# EasyEDA Pro project F40_USB_HUB_2026-08-06.epro

# Schematic Schematic1
Board Name: Board1; Create Date: 2026-07-31; Page Name: P1; Project Name: Simone USB_HUB; Schematic Name: Schematic1; Update Date: 2026-07-31; Company: EasyEDA.com; Page Size: A4; Version: V1.0
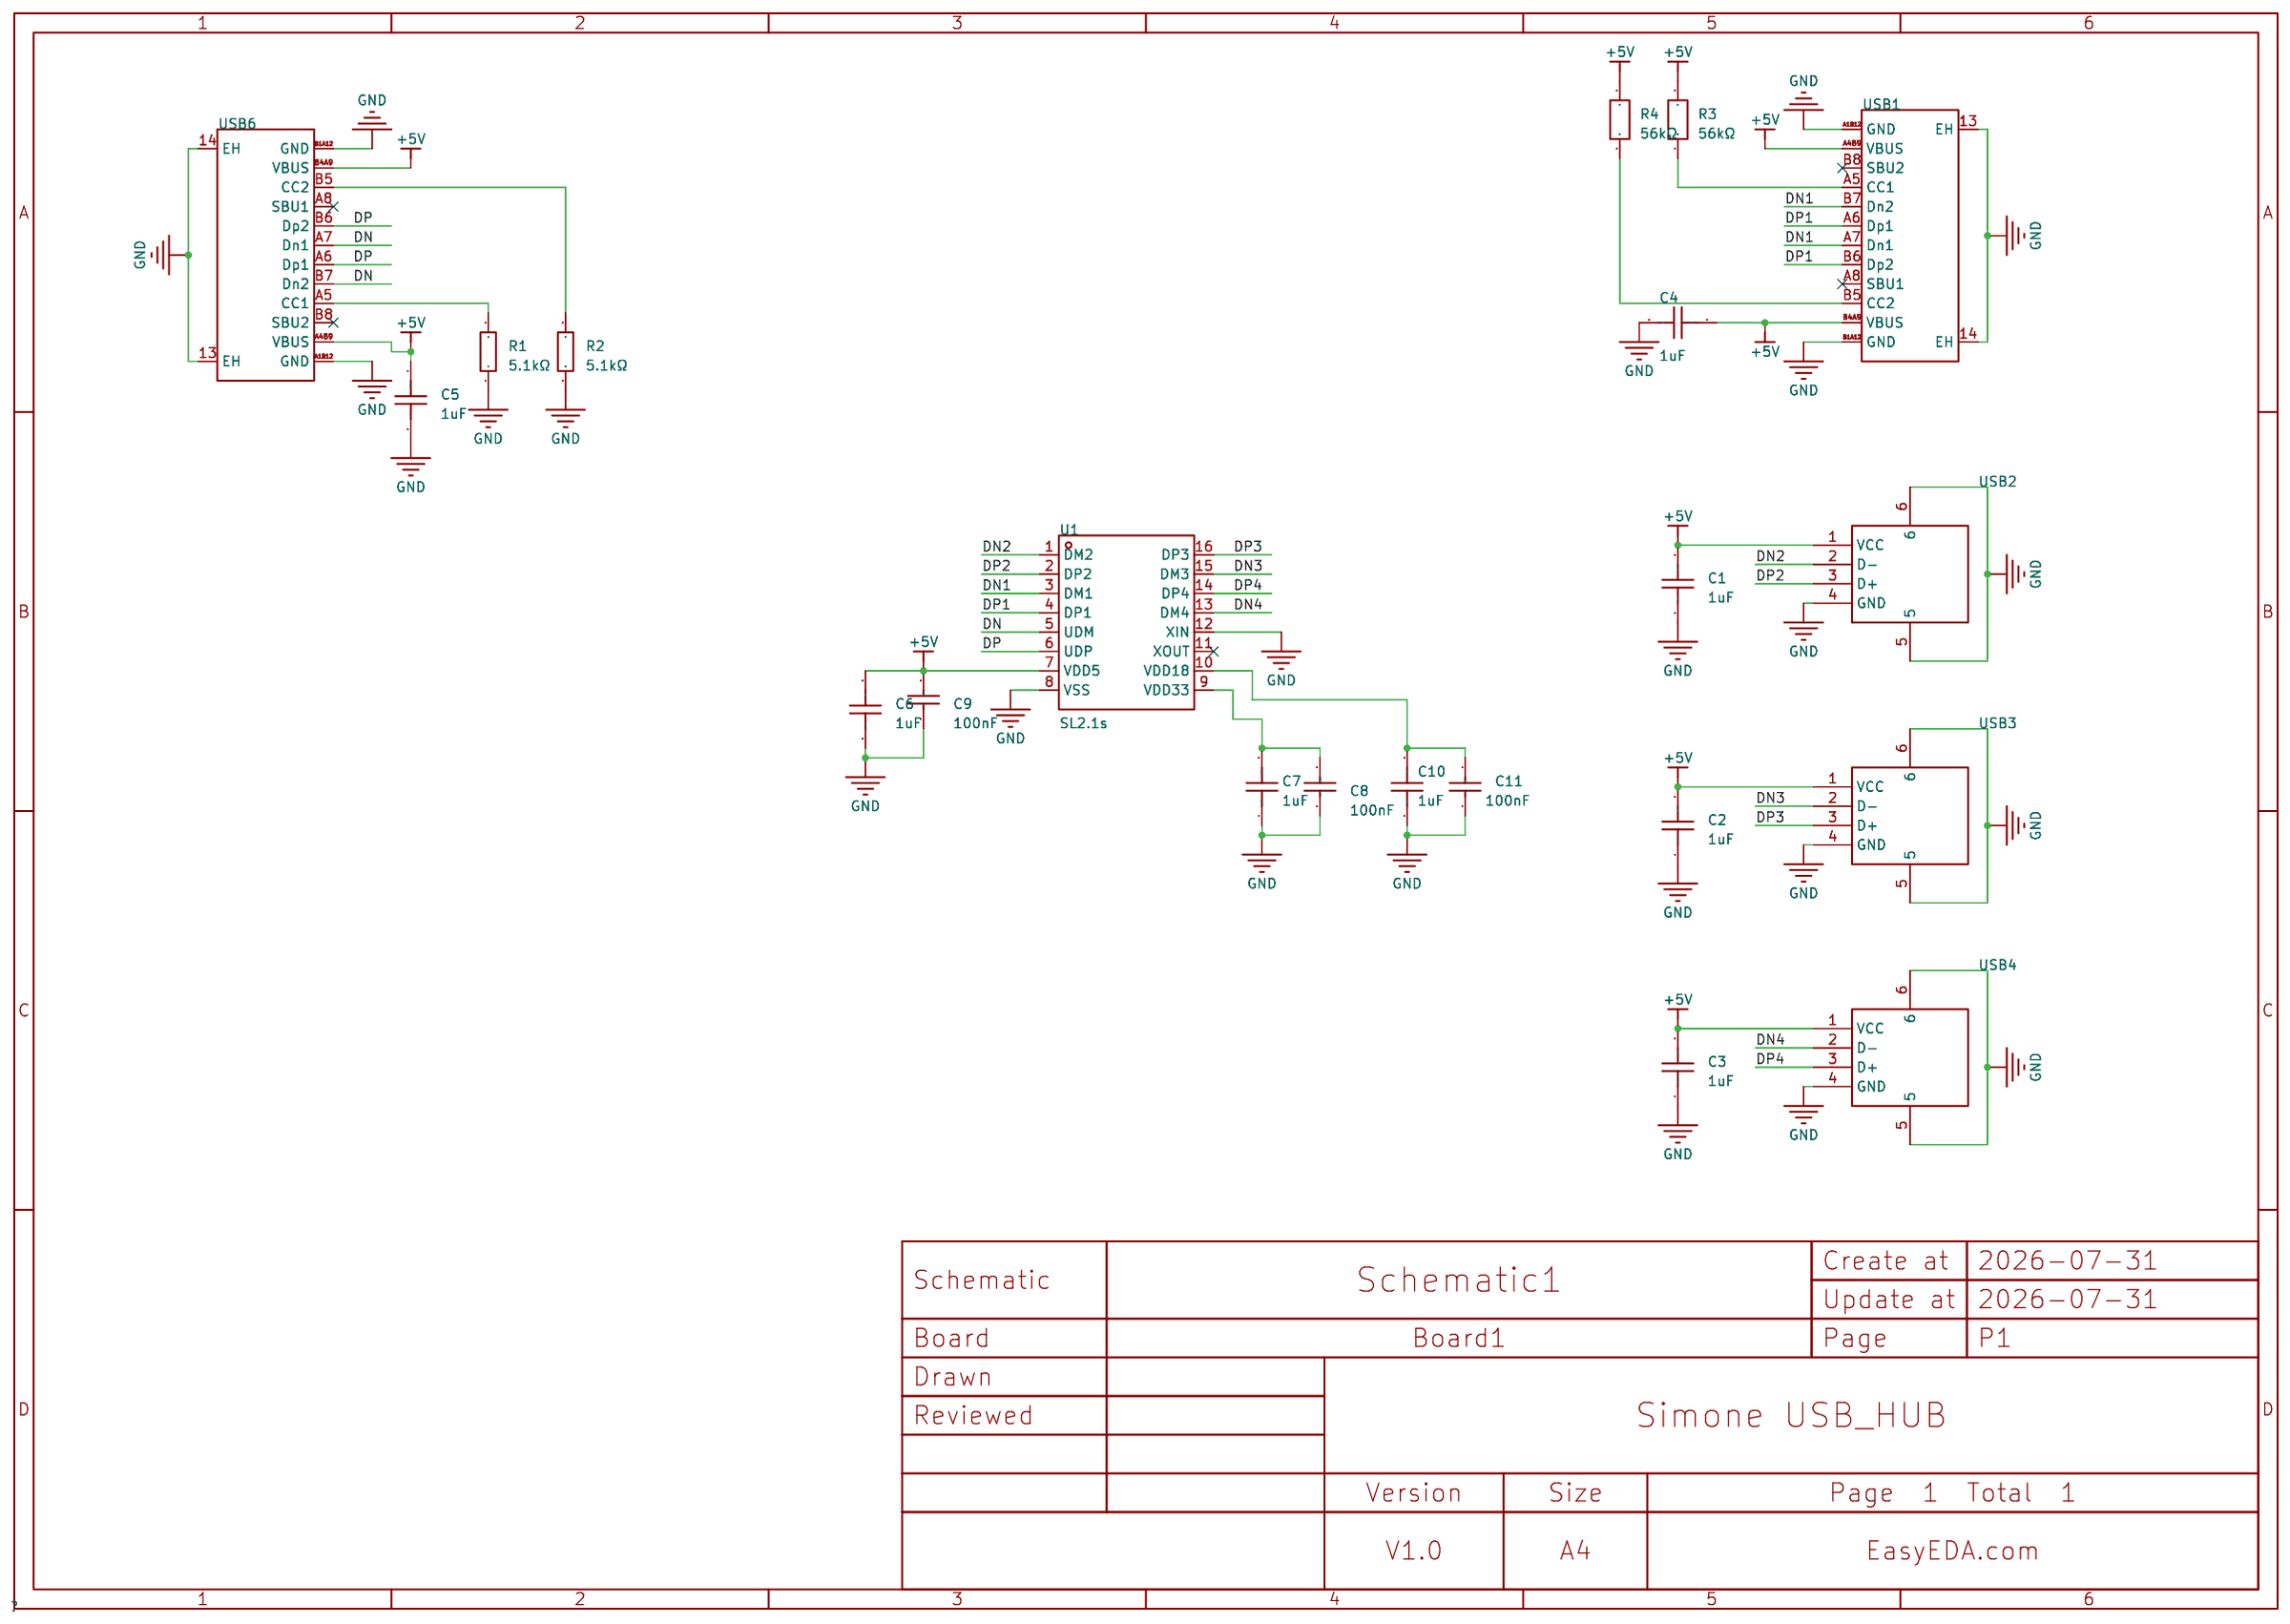
[diagram p0: schematic sheet]

## Parts
C1  1uF  [C0603]
C2  1uF  [C0603]
C3  1uF  [C0603]
C4  1uF  [C0603]
C5  1uF  [C0603]
C6  1uF  [C0603]
C7  1uF  [C0603]
C8  100nF  [C0603]
C9  100nF  [C0603]
C10  1uF  [C0603]
C11  100nF  [C0603]
R1  5.1kΩ  [R0603]
R2  5.1kΩ  [R0603]
R3  56kΩ  [R0603]
R4  56kΩ  [R0603]
U1  SL2.1s  [SSOP-16_L4.6-W2.6-P0.53-LS4.0-BL]
USB1  TYPE-C 16PIN 2MD(073)  [USB-C-SMD_TYPE-C-16PIN-2MD-073]
USB2  10.0 QHHTZB6.3  [USB-A-TH_10.0QHHTZB6.3]
USB3  10.0 QHHTZB6.3  [USB-A-TH_10.0QHHTZB6.3]
USB4  10.0 QHHTZB6.3  [USB-A-TH_10.0QHHTZB6.3]
USB6  TYPE-C 16PIN 2MD(073)  [USB-C-SMD_TYPE-C-16PIN-2MD-073]

## Library data of the parts
C1-C7 C10 = CL10A105KB8NNNC: Capacitance:1uF Tolerance:±10% Tolerance:±10% Voltage Rating:50V Temperature Coefficient:X5R; LCSC Part Name: 1uF ±10% 50V; Supplier Part: C15849; Manufacturer: SAMSUNG(三星); Supplier Footprint: 0603; JLCPCB Part Class: Basic Part; Datasheet: https://item.szlcsc.com/datasheet/CL10A105KB8NNNC/16531.html; Supplier: LCSC; Tolerance: ±10%; Voltage Rating: 50V; Temperature Coefficient: X5R
C8 C9 C11 = CC0603JRX7R9BB104: Capacitance: Tolerance:±5% Tolerance:±5% Voltage Rated: Temperature Coefficient:; LCSC Part Name: 100nF ±5% 50V; Supplier Part: C91183; Manufacturer: YAGEO(国巨); Supplier Footprint: 0603; JLCPCB Part Class: Extended Part; Datasheet: https://atta.szlcsc.com/upload/public/pdf/source/20170919/C131031_1505787245477976978.pdf; Supplier: LCSC; Tolerance: ±5%
R1 R2 = 0603WAF5101T5E: Type:Thick Film Resistor Resistance:5.1kΩ Tolerance:±1% Tolerance:±1% Power(Watts):100mW Voltage-Supply(Max):75V Temperature Coefficient:±100ppm/℃ Temperature Coefficient:±100ppm/℃ Operating Temperature:-55℃~+155℃ Operating Temperature:-55℃~+155℃; LCSC Part Name: 5.1kΩ ±1% 100mW 厚膜电阻; Supplier Part: C23186; Manufacturer: UNI-ROYAL(厚声); Supplier Footprint: 0603; JLCPCB Part Class: Basic Part; Datasheet: https://item.szlcsc.com/datasheet/0603WAF5101T5E/23913.html; Supplier: LCSC; Type: Thick Film Resistor; Tolerance: ±1%; Power(Watts): 100mW; Voltage-Supply(Max): 75V; Temperature Coefficient: ±100ppm/℃; Operating Temperature: -55℃~+155℃
R3 R4 = SCR0603J56K: Type:Thick Film Resistor Resistance:56kΩ Tolerance:±5% Tolerance:±5% Power(Watts):100mW Voltage-Supply(Max):75V Operating Temperature:-55℃~+155℃ Operating Temperature:-55℃~+155℃; LCSC Part Name: 厚膜电阻 56kΩ ±5% 100mW; Supplier Part: C3017697; Manufacturer: VO(翔胜); Supplier Footprint: 0603; JLCPCB Part Class: Extended Part; Datasheet: https://item.szlcsc.com/datasheet/SCR0603J56K/3530221.html; Supplier: LCSC; Type: Thick Film Resistor; Tolerance: ±5%; Power(Watts): 100mW; Voltage-Supply(Max): 75V; Operating Temperature: -55℃~+155℃
U1 = SL2.1s: type:Hub USB Protocol:USB 2.0 Data Rate:- Voltage - Supply:4V~5.25V Voltage - Supply:4V~5.25V Operating Temperature:0℃~+70℃ Operating Temperature:0℃~+70℃ Memory Interface:- Current - Supply:120mA Quiescent Supply Current:2.5mA Number of Channels:4; LCSC Part Name: USB2.0 HUB控制器集成电路; Supplier Part: C2684433; Manufacturer: CoreChips(和芯润德); Supplier Footprint: SSOP-16; JLCPCB Part Class: Extended Part; Datasheet: https://item.szlcsc.com/datasheet/SL2.1s/2782346.html; Supplier: LCSC; type: Hub; USB Protocol: USB 2.0; Voltage - Supply: 4V~5.25V; Operating Temperature: 0℃~+70℃; Current - Supply: 120mA; Quiescent Supply Current: 2.5mA; Number of Channels: 4
USB1 USB6 = TYPE-C 16PIN 2MD(073): Connector Type:Type-C Protocol Standard:- Gender:Female Mounting Type:Surface Mount, Right Angle Number of Contacts:16P Number of Ports:1 Current Rating-Power:3A Voltage Rating:5V Connect-Disconnect Life:10,000 cycles Supplementary Features:- Center Heigh; LCSC Part Name: Type-C 母 卧贴; Supplier Part: C2765186; Manufacturer: SHOU HAN(首韩); Supplier Footprint: SMD; JLCPCB Part Class: Extended Part; Datasheet: https://item.szlcsc.com/datasheet/TYPE-C%252016PIN%25202MD(073)/2901843.html; Supplier: LCSC; Connector Type: Type-C; Gender: Female; Mounting Type: Surface Mount, Right Angle; Number of Contacts: 16P; Number of Ports: 1; Current Rating-Power: 3A; Voltage Rating: 5V; Connect-Disconnect Life: 10,000 cycles; Detection color: Black; Operating Temperature: -25℃~+85℃
USB2-USB4 = 10.0 QHHTZB6.3: Connector Type:Type-A Protocol Standard:USB 2.0 Gender:Female Mounting Type:Surface Mount, Right Angle Number of Contacts:4P Number of Ports:1 Current Rating-Power:1.5A Voltage Rating:30V Connect-Disconnect Life:5,000 times Supplementary Features:- Center; LCSC Part Name: 壳长10.0mm; Supplier Part: C668591; Manufacturer: SHOU HAN(首韩); Supplier Footprint: SMD; JLCPCB Part Class: Extended Part; Datasheet: https://item.szlcsc.com/datasheet/10.0%2520QHHTZB6.3/698534.html; Supplier: LCSC; Connector Type: Type-A; Protocol Standard: USB 2.0; Gender: Female; Mounting Type: Surface Mount, Right Angle; Number of Contacts: 4P; Number of Ports: 1; Current Rating-Power: 1.5A; Voltage Rating: 30V; Connect-Disconnect Life: 5,000 times; Length: 10mm; Detection color: Black; Operating Temperature: -25℃~+85℃

## Nets
+5V: C1.2 C2.2 C3.2 C4.1 C5.1 C6.2 C9.2 R3.2 R4.2 U1.7(VDD5) USB1.A4B9(VBUS) USB1.B4A9(VBUS) USB2.1(VCC) USB3.1(VCC) USB4.1(VCC) USB6.A4B9(VBUS) USB6.B4A9(VBUS)
GND: C1.1 C2.1 C3.1 C4.2 C5.2 C6.1 C7.1 C8.1 C9.1 C10.1 C11.1 R1.1 R2.2 U1.8(VSS) U1.12(XIN) USB1.13(EH) USB1.14(EH) USB1.A1B12(GND) USB1.B1A12(GND) USB2.4(GND) USB2.5 USB2.6 USB3.4(GND) USB3.5 USB3.6 USB4.4(GND) USB4.5 USB4.6 USB6.13(EH) USB6.14(EH) USB6.A1B12(GND) USB6.B1A12(GND)
DN: U1.5(UDM) USB6.A7(Dn1) USB6.B7(Dn2)
DN1: U1.3(DM1) USB1.A7(Dn1) USB1.B7(Dn2)
DN2: U1.1(DM2) USB2.2(D-)
DN3: U1.15(DM3) USB3.2(D-)
DN4: U1.13(DM4) USB4.2(D-)
DP: U1.6(UDP) USB6.A6(Dp1) USB6.B6(Dp2)
DP1: U1.4(DP1) USB1.A6(Dp1) USB1.B6(Dp2)
DP2: U1.2(DP2) USB2.3(D+)
DP3: U1.16(DP3) USB3.3(D+)
DP4: U1.14(DP4) USB4.3(D+)
$1N13: R2.1 USB6.B5(CC2)
$1N14: R1.2 USB6.A5(CC1)
$1N55: R4.1 USB1.B5(CC2)
$1N56: R3.1 USB1.A5(CC1)
$1N68: C10.2 C11.2 U1.10(VDD18)
$1N69: C7.2 C8.2 U1.9(VDD33)

Not connected (* = marked no-connect by the designer): U1 11(XOUT)*; USB1 A8(SBU1)* B8(SBU2)*; USB6 A8(SBU1)* B8(SBU2)*

# Board PCB1
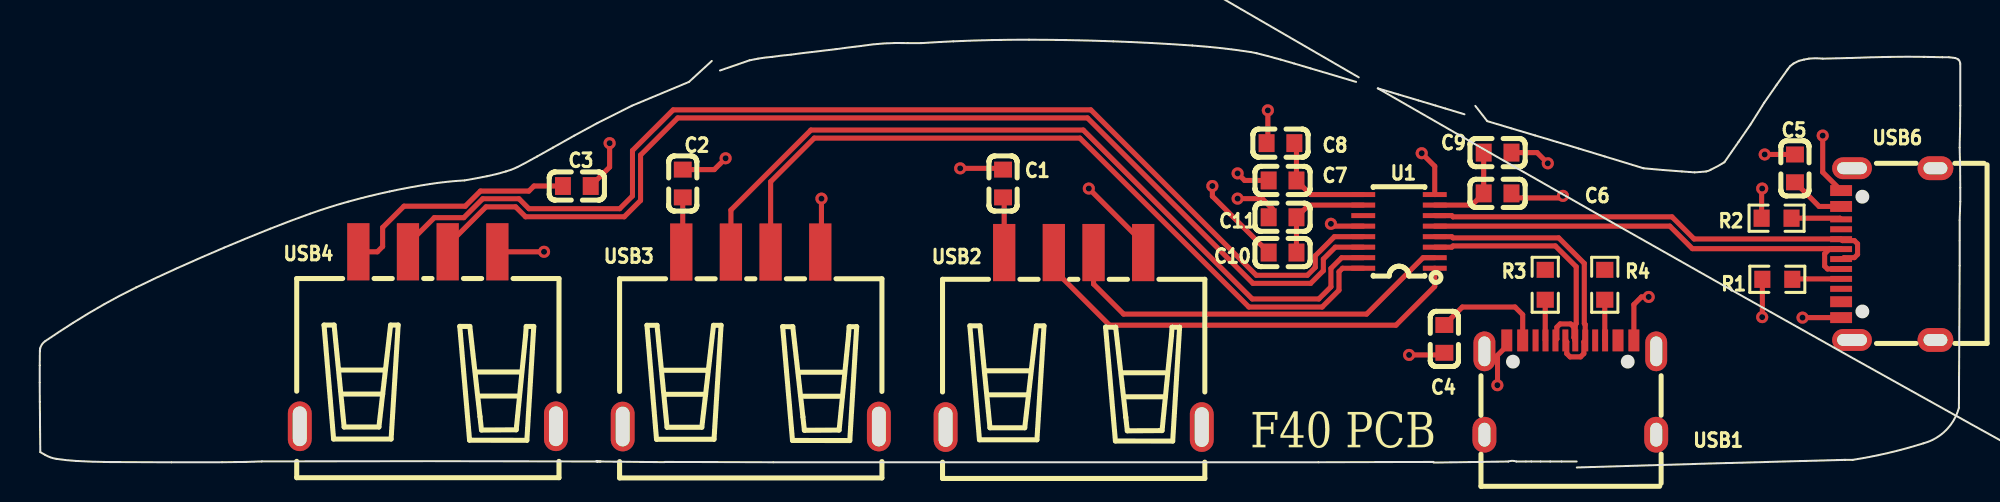
[diagram p1: board, top side]
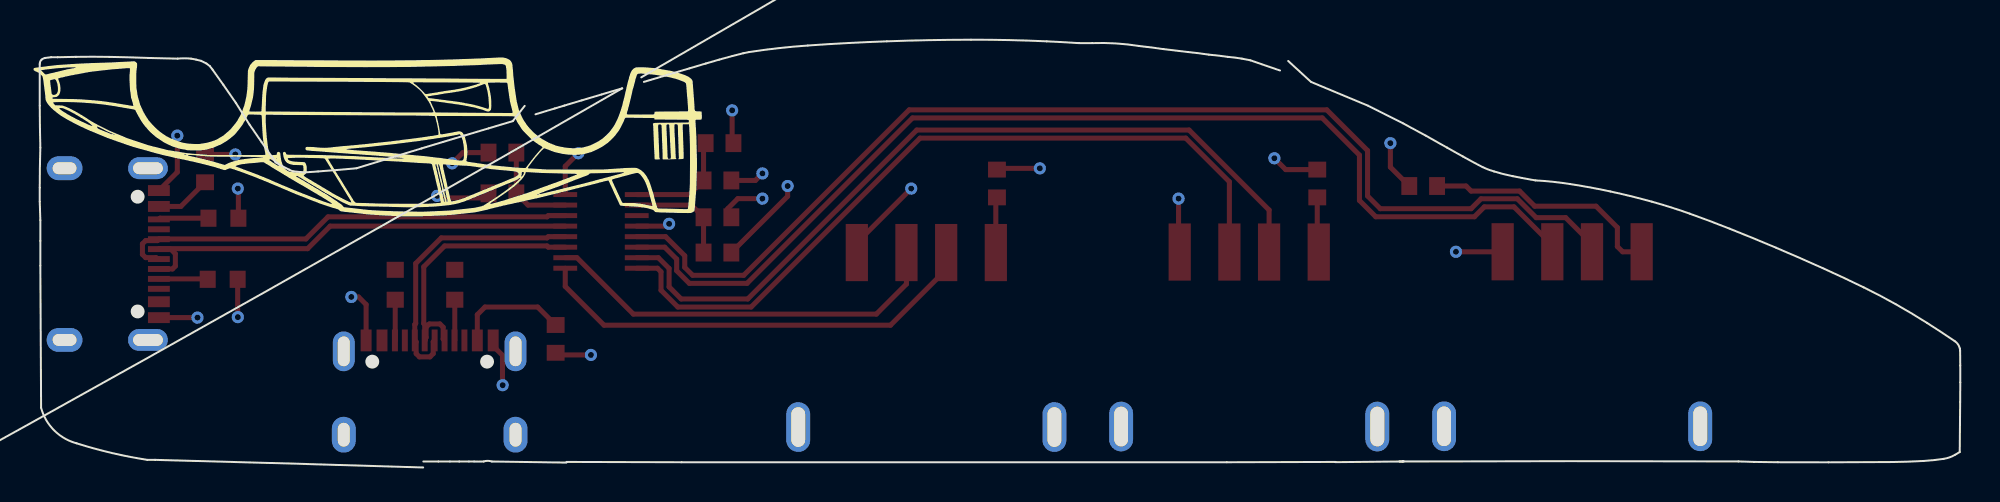
[diagram p2: board, bottom side, seen from below]

Outline 96.71 x 21.29 mm; copper layers: Top Layer, Bottom Layer. Coordinates in mm from the lower left corner of the outline.
Outline path: 28.08,0.05 arc(19.63,0.06) 11.18,0.05 arc(10.79,0.04) 10.41,0.03 arc(9.8,0.01) 9.19,0.01 arc(7.92,0.01) 6.64,0.01 arc(5.06,0.01) 3.48,0.02 arc(2.66,0.04) 1.84,0.07 arc(1.34,0.12) 0.84,0.18 arc(0.55,0.25) 0.27,0.38 0.03,0.52 0.01,3.05 arc(0,3.54) 0,4.03 arc(0,4.46) 0,4.89 arc(0.01,5.25) 0.01,5.62 arc(0.01,5.68) 0.03,5.74 arc(0.12,5.95) 0.28,6.11 arc(0.97,6.57) 1.67,7.03 arc(2.46,7.51) 3.26,7.98 arc(4.06,8.41) 4.87,8.82 arc(5.9,9.31) 6.94,9.79 arc(8.11,10.31) 9.29,10.82 arc(10.45,11.3) 11.61,11.77 arc(12.62,12.16) 13.63,12.53 arc(14.58,12.85) 15.54,13.14 arc(16.58,13.41) 17.62,13.65 arc(18.64,13.85) 19.65,14.02 arc(20.53,14.14) 21.4,14.21 arc(21.97,14.31) 22.53,14.42 arc(23.01,14.52) 23.48,14.66 arc(23.77,14.75) 24.05,14.87 arc(24.56,15.14) 25.06,15.41 arc(25.45,15.64) 25.85,15.86 arc(26.38,16.16) 26.92,16.46 arc(27.5,16.78) 28.08,17.09 arc(28.95,17.53) 29.83,17.97 32.7,19.17 arc(33.17,20.21) 34.24,19.79 arc(35.4,19.75) 35.75,20.26 arc(35.96,20.3) 36.17,20.34 arc(36.53,20.39) 36.89,20.43 arc(37.36,20.49) 37.84,20.54 arc(38.36,20.61) 38.88,20.67 40.11,20.82 arc(40.74,20.9) 41.37,20.98 arc(42.54,21.11) 43.71,21.12 arc(44.05,21.12) 44.38,21.12 arc(45.2,21.17) 46.01,21.21 arc(47.91,21.27) 49.82,21.29 arc(51.94,21.27) 54.06,21.21 arc(56.05,21.12) 58.05,21 arc(59.52,20.87) 60.99,20.67 arc(61.13,20.65) 61.28,20.61 arc(61.56,20.54) 61.84,20.47 arc(62.17,20.38) 62.49,20.29 arc(62.83,20.19) 63.17,20.09 arc(1419.49,284.62) 63.99,19.85 66.29,19.17 arc(66.92,19.27) 67.38,18.84 arc(67.9,18.69) 68.42,18.54 arc(68.92,18.39) 69.43,18.24 arc(69.86,18.11) 70.29,17.98 arc(70.53,17.9) 70.78,17.83 arc(71.26,17.68) 71.75,17.54 arc(72.32,17.36) 72.89,17.19 arc(73.5,17.01) 74.11,16.83 arc(74.7,16.65) 75.3,16.47 arc(75.86,16.31) 76.42,16.14 arc(76.96,15.98) 77.49,15.81 arc(78.15,15.62) 78.81,15.41 arc(817.54,-1867.16) 80.76,14.82 arc(81.73,14.73) 82.69,14.66 arc(82.89,14.64) 83.09,14.63 arc(83.21,14.62) 83.33,14.61 arc(83.47,14.62) 83.6,14.63 arc(83.76,14.64) 83.92,14.66 arc(84.04,14.69) 84.15,14.74 arc(84.5,14.92) 84.84,15.12 arc(85.19,15.63) 85.54,16.14 arc(85.85,16.58) 86.15,17.02 arc(86.5,17.57) 86.84,18.12 arc(87.16,18.57) 87.47,19.03 arc(87.75,19.41) 88.02,19.79 arc(88.08,19.88) 88.15,19.96 arc(88.23,20.03) 88.32,20.1 arc(88.45,20.16) 88.59,20.23 arc(88.71,20.26) 88.84,20.29 arc(88.97,20.32) 89.09,20.34 arc(89.44,20.36) 89.78,20.34 arc(90.52,20.36) 91.26,20.37 arc(92.23,20.41) 93.2,20.43 arc(94.05,20.44) 94.89,20.43 arc(95.35,20.42) 95.81,20.41 arc(95.98,20.41) 96.14,20.41 arc(96.29,20.4) 96.44,20.37 arc(96.54,20.34) 96.62,20.29 arc(96.69,20.19) 96.71,20.07 arc(96.72,19.02) 96.71,17.97 arc(96.71,16.91) 96.68,15.86 arc(96.71,14.85) 96.71,13.84 arc(96.72,13.49) 96.71,13.14 arc(96.7,12.67) 96.68,12.2 arc(96.69,11.68) 96.68,11.16 arc(96.69,10.54) 96.68,9.91 96.65,2.75 arc(95.99,1.62) 94.86,0.96 arc(93.1,0.48) 91.3,0.13 arc(91.1,0.13) 90.9,0.13 arc(91.49,-1202.3) 77.4,0.05 arc(77.02,0.05) 76.64,0.05 arc(76.35,0.05) 76.07,0.05 arc(75.83,0.05) 75.59,0.05 arc(75.35,0.05) 75.11,0.05 arc(74.98,0.05) 74.84,0.05 arc(74.6,0.04) 74.36,0.05 arc(74.16,0.08) 73.95,0.05 arc(25.06,-158.66) 70.19,0.02 arc(67.29,0.01) 64.39,0.01 36.94,0.01 arc(34.21,0.01) 31.47,0.02 arc(30.69,141.17) 28.08,0.05 ; 28.08,0.05 arc(28.05,0.05) 28.03,0.05 arc(67.46,1199.52) 28.24,0.05 arc(28.16,0.05) 28.08,0.05
Stack: Top Layer 0.035mm / Dielectric1 1.51mm FR4 er 4.5 / Bottom Layer 0.035mm

## Design rules (mm)
net DN2: DP3
net DP2: DP3
net DN1: DP2
net DP1: DP2
net DN: DP1
net DP: DP1
net DN4: DP4
net DP4: DP4
net DN3: DP5
net DP3: DP5
spacing copperThickness1oz (default): track to track 0.102, other pairs 0.152 to 0.3
spacing copperThickness2oz: track to track 0.203, other pairs 0.152 to 0.3
track width copperThickness1oz (default): min 0.127, default 0.254, max 2.54
track width copperThickness2oz: min 0.203, default 0.254, max 2.54
differential pair differentialPair (default): width min 0.127, default 0.254, max 2.54; gap min 0.152, default 0.152
net +5V uses copperRegion
net GND uses copperRegion

## Placement (name value [footprint] x y rotation side)
C1  1uF  [C0603]  48.51 14.04 270 top
C2  1uF  [C0603]  32.38 14.04 270 top
C3  1uF  [C0603]  27.05 13.92 180 top
C4  1uF  [C0603]  70.73 6.22 270 top
C5  1uF  [C0603]  88.39 14.81 90 top
C6  1uF  [C0603]  73.41 13.55 180 top
C7  1uF  [C0603]  62.58 14.2 0 top
C8  100nF  [C0603]  62.48 16.08 0 top
C9  100nF  [C0603]  73.41 15.6 180 top
C10  1uF  [C0603]  62.58 10.57 0 top
C11  100nF  [C0603]  62.58 12.34 0 top
R1  5.1kΩ  [R0603]  87.5 9.22 0 top
R2  5.1kΩ  [R0603]  87.46 12.3 180 top
R3  56kΩ  [R0603]  75.81 8.94 90 top
R4  56kΩ  [R0603]  78.81 8.94 90 top
U1  SL2.1s  [SSOP-16_L4.6-W2.6-P0.53-LS4.0-BL]  68.45 11.63 90 top
USB1  TYPE-C 16PIN 2MD(073)  [USB-C-SMD_TYPE-C-16PIN-2MD-073]  77.08 3.77 0 top
USB2  10.0 QHHTZB6.3  [USB-A-TH_10.0QHHTZB6.3]  52.07 6.17 0 top
USB3  10.0 QHHTZB6.3  [USB-A-TH_10.0QHHTZB6.3]  35.81 6.2 0 top
USB4  10.0 QHHTZB6.3  [USB-A-TH_10.0QHHTZB6.3]  19.54 6.21 0 top
USB6  TYPE-C 16PIN 2MD(073)  [USB-C-SMD_TYPE-C-16PIN-2MD-073]  93.09 10.49 90 top

## Footprints (pads in the part's own frame, mm; a bottom-side part is the same pattern mirrored in y, then rotated)
C0603
  rect 0.8x0.9 smd: 1(-0.7,0) 2(0.7,0)
R0603
  rect 0.806x0.864 smd: 1(-0.753,0) 2(0.753,0)
SSOP-16_L4.6-W2.6-P0.53-LS4.0-BL
  rect 0.25x1.2 smd: 1(-1.855,-1.8) 2(-1.325,-1.8) 3(-0.795,-1.8) 4(-0.265,-1.8) 5(0.265,-1.8) 6(0.795,-1.8) 7(1.325,-1.8) 8(1.855,-1.8) 9(1.855,1.8) 10(1.325,1.8) 11(0.795,1.8) 12(0.265,1.8) 13(-0.265,1.8) 14(-0.795,1.8) 15(-1.325,1.8) 16(-1.855,1.8)
USB-A-TH_10.0QHHTZB6.3
  rect 1.12x2.88 smd: 1(-3.5,4.395) 2(-1,4.395) 3(1,4.395) 4(3.5,4.395)
  oval 1.2x2.5 hole 0.7x2: 5(-6.45,-4.395) 6(6.45,-4.395)
USB-C-SMD_TYPE-C-16PIN-2MD-073
  oval 1.1x2 hole 0.6x1.5: 13(-4.325,1.825) 14(4.325,1.825)
  oval 1.2x1.8 hole 0.6x1.2: 13(-4.325,-2.375) 14(4.325,-2.375)
  rect 0.55x1.1 smd: A1B12(-3.2,2.375) A4B9(-2.4,2.375) B1A12(3.2,2.375) B4A9(2.4,2.375)
  rect 0.3x1.1 smd: A5(-1.25,2.375) A6(-0.25,2.375) A7(0.25,2.375) A8(1.25,2.375) B5(1.75,2.375) B6(0.75,2.375) B7(-0.75,2.375) B8(-1.75,2.375)

## Nets
As in the schematic.

Pads without a net: U1 11; USB1 A8 B8; USB6 A8 B8

## Via types
v1: diameter 0.61, hole 0.305, Top Layer to Bottom Layer, 22 vias

## Routing (per net, layer and track width the routed paths; a pad name or vN(x,y) marks a point on that pad's centre or on a via; arc(x,y) is an arc through that point)
+5V: length 31.2
  Top Layer w0.254: USB4.1 17,10.6 17.27,10.87 17.27,11.83 18.34,12.9 21.43,12.9 22.19,13.66 24.63,13.66 24.89,13.92 C3.2 ; 48.51,13.34 48.57,13.29 USB2.1 ; C5.1 89.61,12.89 USB6.B4A9 ; USB1.A4B9 74.68,7.43 74.29,7.82 71.64,7.82 C4.1 ; 32.38,13.34 32.38,10.67 USB3.1 ; 70.25,12.96 72.12,12.96 C6.2 C9.2
GND: length 52.7
  Top Layer w0.254: 61.88,12.34 62.06,12.52 62.06,12.78 61.56,13.28 v1(60.32,13.28) ; C1.1 48.45,14.81 v1(46.35,14.81) ; v1(86.74,13.79) 86.71,13.76 R2.2 ; USB1.A1B12 73.88,5.86 73.41,5.39 73.41,3.89 v1(73.4,3.88) ; v1(89.78,16.46) 89.78,14.61 USB6.B1A12 ; 61.88,10.56 59.05,13.4 v1(59.05,13.92) ; v1(86.74,7.31) 86.75,7.32 R1.1 ; v1(28.7,16.08) 28.7,14.87 C3.1 ; v1(52.83,13.79) 55.57,11.05 USB2.4 ; v1(39.37,13.28) 39.37,10.65 USB3.4 ; v1(75.94,15.06) 75.4,15.6 C9.1 ; 61.88,16.1 61.84,16.14 v1(61.84,17.73) ; USB4.4 v1(25.4,10.6) ; C5.2 v1(86.86,15.51) ; v1(69.59,15.57) 70.25,14.91 70.25,13.49 ; 61.88,14.2 60.68,14.2 v1(60.32,14.55) ; C2.1 33.97,14.74 v1(34.54,15.31) ; v1(68.96,5.41) 70.62,5.41 C4.2 ; USB1.B1A12 80.28,7.95 80.66,8.33 v1(81.02,8.33) ; v1(76.7,13.42) 76.6,13.32 74.34,13.32 C6.1 ; USB6.A1B12 v1(88.77,7.29) ; v1(65.02,12.01) 65.14,11.9 U1.12
DN: length 23.4
  Top Layer w0.254: 90.71,10.74 USB6.A7 ; 90.71,10.74 90.12,10.74 89.88,10.5 89.88,9.88 90.03,9.74 USB6.B7 ; 90.71,10.74 90.69,10.76 83.22,10.76 82.09,11.9 70.25,11.9
DN1: length 13.7
  Top Layer w0.254: 76.33,6.14 76.4,6.21 76.4,6.8 76.56,6.97 77.09,6.97 77.26,6.8 77.26,6.28 77.3,6.24 77.3,6.16 77.33,6.14 77.33,6.94 77.37,6.99 77.37,9.85 76.32,10.9 71.16,10.9 71.1,10.84 70.25,10.84
DN2: length 22.9
  Top Layer w0.254: USB2.2 51.07,9.71 53.87,6.91 68.3,6.91 70.25,8.86 70.25,9.78
DN3: length 40.6
  Top Layer w0.254: U1.15 65.56,10.31 65.02,9.76 65.02,8.84 64.41,8.23 61.06,8.23 52.55,16.74 38.83,16.74 34.81,12.71 USB3.2
DN4: length 57.6
  Top Layer w0.254: U1.13 65.2,11.37 64.23,10.4 64.23,9.82 63.83,9.42 61.26,9.42 52.93,17.75 31.9,17.75 29.85,15.7 29.85,13.42 29.21,12.77 24.63,12.77 24.13,13.27 22.31,13.27 21.36,12.32 19.87,12.32 18.54,11 USB4.2
DP: length 23.3
  Top Layer w0.254: USB6.A6 90.73,10.26 90.81,10.26 90.86,10.31 91.38,10.31 91.54,10.47 91.54,11 91.38,11.17 90.78,11.17 USB6.B6 90.7,11.25 83.31,11.25 82.19,12.36 71.16,12.36 71.1,12.43 70.25,12.43
DP1: length 14.4
  Top Layer w0.254: USB1.A6 76.9,6.07 76.9,5.47 77.06,5.31 77.59,5.31 77.76,5.47 77.76,6.07 USB1.B6 77.83,6.94 77.78,6.99 77.78,10.02 76.49,11.3 71.16,11.3 71.1,11.37 70.25,11.37
DP2: length 20.6
  Top Layer w0.254: USB2.3 53.07,8.98 54.58,7.46 66.82,7.46 69.66,10.31 70.25,10.31
DP3: length 39.2
  Top Layer w0.254: USB3.3 36.81,14.13 39,16.33 52.38,16.33 60.89,7.82 64.58,7.82 65.43,8.67 65.43,9.6 65.61,9.78 U1.16
DP4: length 55.4
  Top Layer w0.254: USB4.3 20.54,10.94 22.47,12.87 23.97,12.87 24.47,12.37 29.43,12.37 30.26,13.19 30.26,15.47 32.13,17.35 52.76,17.35 61.09,9.01 64,9.01 64.64,9.65 64.64,10.23 65.24,10.84 U1.14
$1N13: length 2.5
  Top Layer w0.254: R2.1 90.65,12.3 USB6.B5
$1N14: length 2.5
  Top Layer w0.254: USB6.A5 88.27,9.24 R1.2
$1N55: length 2.1
  Top Layer w0.254: R4.1 78.81,6.15 78.83,6.14
$1N56: length 2.1
  Top Layer w0.254: 75.83,6.14 75.81,6.15 R3.1
$1N68: length 5.4
  Top Layer w0.254: C10.2 C11.2 63.9,12.96 U1.10
$1N69: length 5.6
  Top Layer w0.254: 63.28,16.1 C7.2 64,13.49 U1.9

## Copper pours and planes (outline as drawn; the poured copper is in the pictures)
+5V on Top Layer: -3.05,28.9 99.56,28.9 99.56,-2.08 -3.05,-2.08
GND on Bottom Layer: -4.83,34.11 100.71,34.11 100.71,-6.91 -4.83,-6.91

## Text on the board
Top Silkscreen Layer: F40 PCB
